# EAGLE schematic Schematic (EAGLE 6.3)
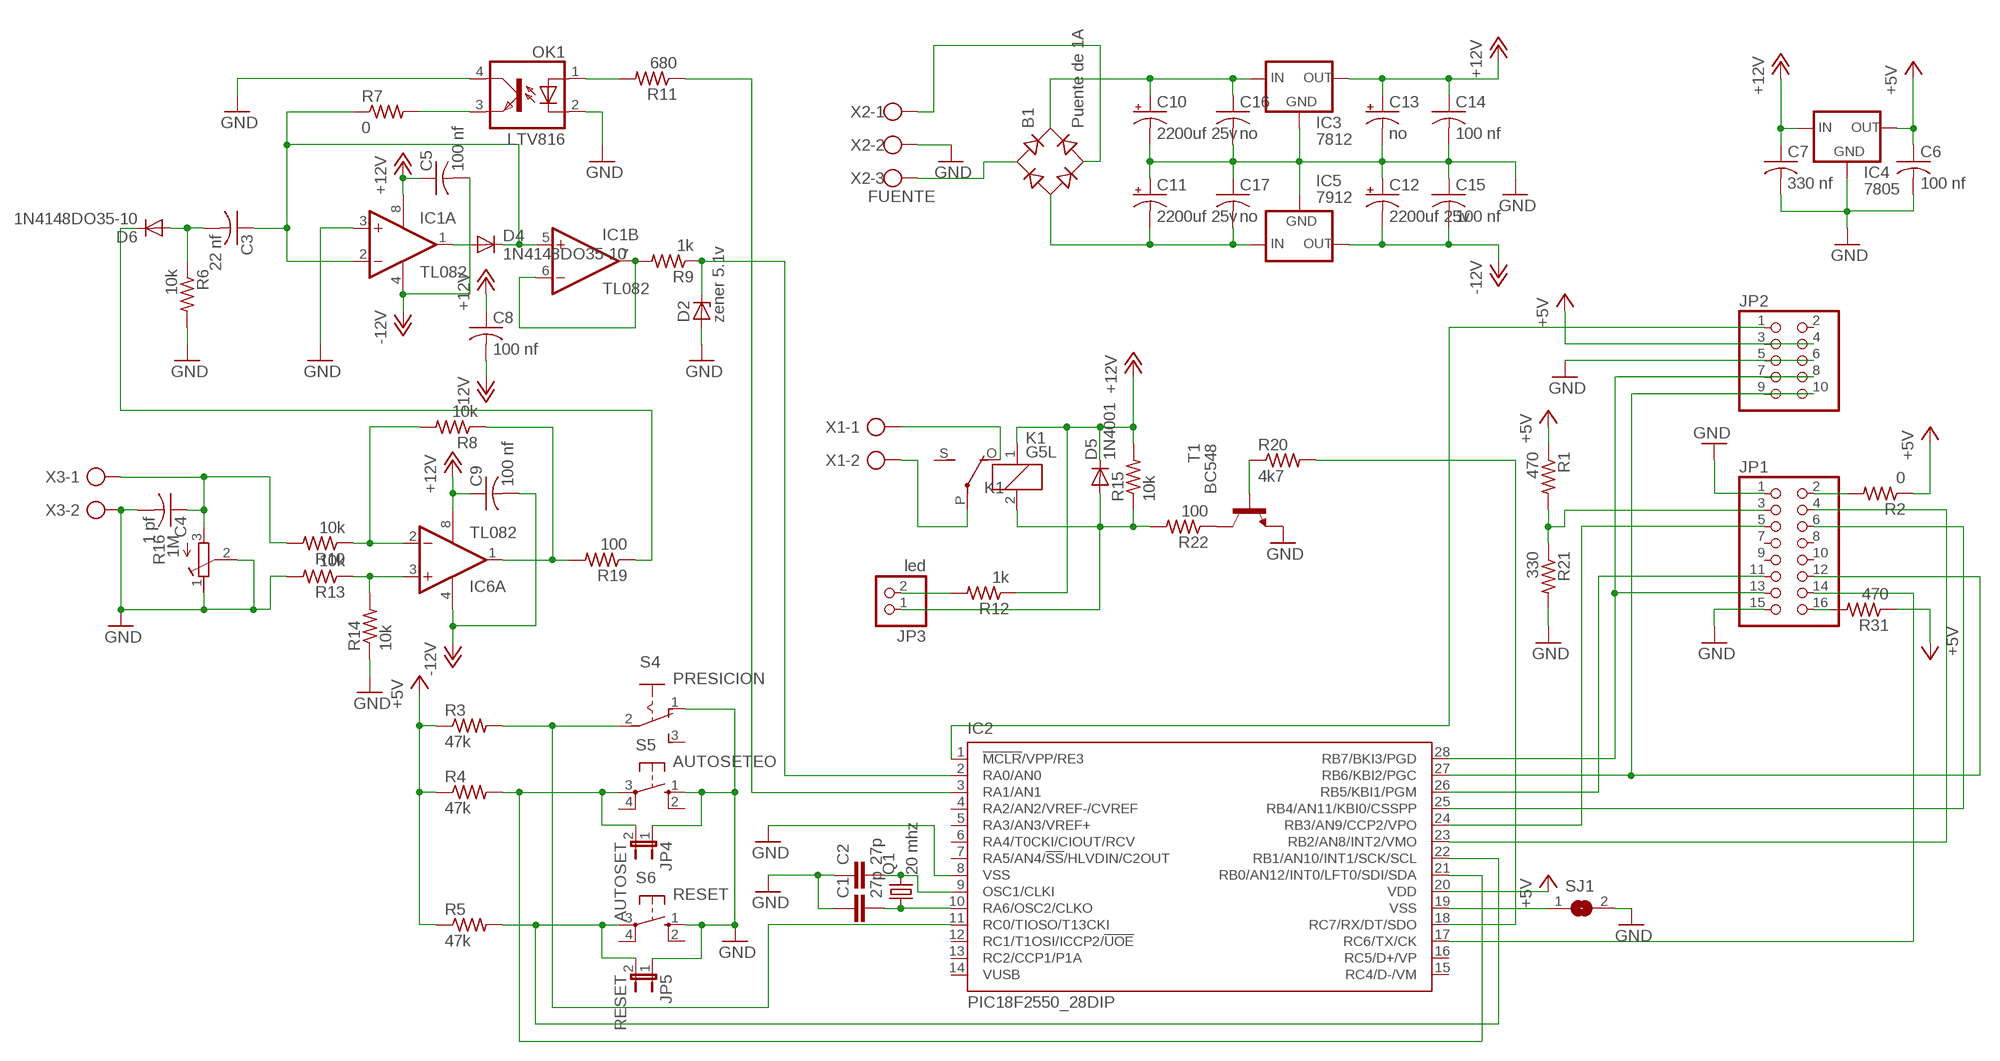
[diagram p0: schematic, sheet 1]

## Parts
B1  Puente de 1A  RB1A  [RB1A]
C1  27p  C-EU050-024X044  [C050-024X044]
C2  27p  C-EU050-024X044  [C050-024X044]
C3  22 nf  C-US050-024X044  [C050-024X044]
C4  1 pf  C-US050-024X044  [C050-024X044]
C5  100 nf  C-US050-024X044  [C050-024X044]
C6  100 nf  C-US050-024X044  [C050-024X044]
C7  330 nf  C-US050-024X044  [C050-024X044]
C8  100 nf  C-US050-024X044  [C050-024X044]
C9  100 nf  C-US050-024X044  [C050-024X044]
C10  2200uf 25v  CPOL-USE7.5-16  [E7,5-16]
C11  2200uf 25v  CPOL-USE7.5-16  [E7,5-16]
C12  2200uf 25v  CPOL-USE7.5-16  [E7,5-16]
C13  no  CPOL-USE7.5-16  [E7,5-16]
C14  100 nf  C-US050-024X044  [C050-024X044]
C15  100 nf  C-US050-024X044  [C050-024X044]
C16  no  C-US050-024X044  [C050-024X044]
C17  no  C-US050-024X044  [C050-024X044]
D2  zener 5.1v  ZENER-DIODEP1-Z12  [P1Z12]
D4  1N4148DO35-10  [DO35-10]
D5  1N4001  1N4004  [DO41-10]
D6  1N4148DO35-10  [DO35-10]
IC1  TL082  LM4558N  [DIL08]
IC2  PIC18F2550_28DIP  [DIL28-3]
IC3  7812  78XXS  [78XXS]
IC4  7805  78XXS  [78XXS]
IC5  7912  79XXS  [79XXS]
IC6  TL082  LM4558N  [DIL08]
JP1  PINHD-2X8  [2X08]
JP2  PINHD-2X5  [2X05]
JP3  led  PINHD-1X2  [1X02]
JP4  AUTOSET  JP1E  [JP1]
JP5  RESET  JP1E  [JP1]
K1  G5L  [G5LE]
OK1  LTV816  [DIL04]
Q1  20 mhz  CRYSTALHC49S  [HC49/S]
R1  470  R-US_0207/10  [0207/10]
R2  0  R-US_0207/10  [0207/10]
R3  47k  R-US_0207/10  [0207/10]
R4  47k  R-US_0207/10  [0207/10]
R5  47k  R-US_0207/10  [0207/10]
R6  10k  R-US_0207/10  [0207/10]
R7  0  R-US_0207/10  [0207/10]
R8  10k  R-US_0207/10  [0207/10]
R9  1k  R-US_0207/10  [0207/10]
R10  10k  R-US_0207/10  [0207/10]
R11  680  R-US_0207/10  [0207/10]
R12  1k  R-US_0207/10  [0207/10]
R13  10k  R-US_0207/10  [0207/10]
R14  10k  R-US_0207/10  [0207/10]
R15  10k  R-US_0207/10  [0207/10]
R16  1M  R-TRIMMT93YA  [RTRIMT93YA]
R19  100  R-US_0207/10  [0207/10]
R20  4k7  R-US_0207/10  [0207/10]
R21  330  R-US_0207/10  [0207/10]
R22  100  R-US_0207/10  [0207/10]
R31  470  R-US_0207/10  [0207/10]
S4  PRESICION  M251  [M251]
S5  AUTOSETEO  10-XX  [B3F-10XX]
S6  RESET  10-XX  [B3F-10XX]
SJ1  SJ  [SJ]
T1  BC548  BC547  [TO92]
X1  AK300/2  [AK300/2]
X2  FUENTE  W237-103  [W237-103]
X3  AK300/2  [AK300/2]

## Nets
+5V: C6.1 IC2.20(VDD) IC4.OUT JP2.3 JP2.4 R1.1 R2.1 R3.1 R4.1 R5.1 R31.1
+12V: C5.1 C7.1 C8.1 C9.1 C13.+ C14.1 D5.C IC1.8(P:V+) IC3.OUT IC4.IN IC6.8(P:V+) K1.1 R12.1 R15.2
-12V: C5.2 C8.2 C9.2 C12.- C15.2 IC1.4(P:V-) IC5.OUT IC6.4(P:V-)
GND: C1.1 C2.1 C4.2 C6.2 C7.2 C10.- C11.+ C12.+ C13.- C14.2 C15.1 C16.2 C17.1 D2.A IC1.3(A:+IN) IC2.8(VSS) IC3.GND IC4.GND IC5.GND JP1.1 JP1.15 JP2.5 JP2.6 JP4.1 JP5.1 OK1.2(C) OK1.4(COL) R6.2 R13.2 R14.1 R16.1(A) R16.2(S) R21.2 S4.1(O) S5.1(S) S6.1(S) SJ1.2 T1.1(E) X2.2 X3.2
N$1: IC6.3(A:+IN) R13.1 R14.2
N$2: JP1.3 R1.2 R21.1
N$3: D6.C R19.1
N$4: JP1.2 R2.2
N$5: JP1.16 R31.2
N$6: C3.2 D6.A R6.1
N$7: IC6.2(A:-IN) R8.2 R10.1
N$8: IC2.23(RB2/AN8/INT2/VMO) JP1.4
N$9: IC2.24(RB3/AN9/CCP2/VPO) JP1.5
N$10: IC2.25(RB4/AN11/KBI0/CSSPP) JP1.6
N$11: IC2.26(RB5/KBI1/PGM) JP1.11
N$12: IC2.27(RB6/KBI2/PGC) JP1.12 JP2.9 JP2.10
N$13: IC2.11(RC0/TIOSO/T13CKI) R3.2 S4.2(P)
N$14: IC2.21(RB0/AN12/INT0/LFT0/SDI/SDA) JP4.2 R4.2 S5.3(P)
N$15: IC2.22(RB1/AN10/INT1/SCK/SCL) JP5.2 R5.2 S6.3(P)
N$16: JP3.2 R12.2
N$17: IC2.28(RB7/BKI3/PGD) JP1.13 JP2.7 JP2.8
N$18: IC2.19(VSS) SJ1.1
N$19: IC2.17(RC6/TX/CK) JP1.14
N$20: C3.1 D4.C IC1.2(A:-IN) IC1.5(B:+IN) R7.1
N$21: IC6.1(A:OUT) R8.1 R19.2
N$22: D4.A IC1.1(A:OUT)
N$23: IC2.1(!MCLR!/VPP/RE3) JP2.1
N$24: C2.2 IC2.9(OSC1/CLKI) Q1.2
N$25: C1.2 IC2.10(RA6/OSC2/CLKO) Q1.1
N$26: B1.+ C10.+ C16.1 IC3.IN
N$27: OK1.1(A) R11.2
N$28: OK1.3(EMIT) R7.2
N$29: IC1.6(B:-IN) IC1.7(B:OUT) R9.2
N$30: K1.P(2:P) X1.2
N$31: B1.- C11.- C17.2 IC5.IN
N$32: B1.AC2 X2.1
N$33: B1.AC1 X2.3
N$34: K1.O(2:O) X1.1
N$35: IC2.18(RC7/RX/DT/SDO) R20.2
N$36: D5.A JP3.1 K1.2 R15.1 R22.2
N$39: D2.C IC2.2(RA0/AN0) R9.1
N$40: IC2.3(RA1/AN1) R11.1
N$45: R22.1 T1.3(C)
N$51: C4.1 R10.2 R16.3(E) X3.1
N$55: R20.1 T1.2(B)
Unconnected: IC2.4(RA2/AN2/VREF-/CVREF) IC2.5(RA3/AN3/VREF+) IC2.6(RA4/T0CKI/CIOUT/RCV) IC2.7(RA5/AN4/!SS!/HLVDIN/C2OUT) IC2.12(RC1/T1OSI/ICCP2/!UOE) IC2.13(RC2/CCP1/P1A) IC2.14(VUSB) IC2.15(RC4/D-/VM) IC2.16(RC5/D+/VP) IC6.5(B:+IN) IC6.6(B:-IN) IC6.7(B:OUT) JP1.7 JP1.8 JP1.9 JP1.10 JP2.2 K1.S(2:S) S4.3(S) S5.2(S1) S5.4(P1) S6.2(S1) S6.4(P1)

## Library data of the parts
B1 = rectifier:RB1A: RECTIFIER 1 A
C1 C2 = rcl:C-EU: CAPACITOR, European symbol
C3-C9 C14-C17 = rcl:C-US: CAPACITOR, American symbol
C10-C13 = rcl:CPOL-US: POLARIZED CAPACITOR, American symbol
D2 = diode:ZENER-DIODE: Z-Diode
D4 D6 = diode:1N4148: DIODE high speed (Philips)
D5 = diode:1N4004: DIODE general purpose rectifier, 1 A
IC1 IC6 = linear:*4558: OP AMP
IC2 = microchip:PIC18F2*_28: USB Microcontrollers with nanoWatt Technology High-Performance, Enhanced Flash, 28/40/44-Pin, Source: http://ww1.microchip.com/downloads/en/devicedoc/39632c.pdf
IC3 IC4 = v-reg:78XXS: VOLTAGE REGULATOR
IC5 = v-reg:79XXS: VOLTAGE REGULATOR
JP1 = pinhead:PINHD-2X8: PIN HEADER
JP2 = pinhead:PINHD-2X5: PIN HEADER
JP3 = pinhead:PINHD-1X2: PIN HEADER
JP4 JP5 = jumper:JP1E: JUMPER
K1 = relay:G5L: RELAY 1 x switch, 10 A/120 V AC, 8 A/30 V ADC, Omron
OK1 = optocoupler:LTV816: OPTO COUPLER Source: LITEON, LTV816.pdf; OC_FARNELL: unknown; OC_NEWARK: unknown
Q1 = crystal:CRYSTAL: CRYSTAL
R1-R15 R19-R22 R31 = resistor:R-US_: RESISTOR, American symbol
R16 = resistor:R-TRIMM: Trimm resistor
S4 = switch:M251: SLIDING SWITCH Mors, distributor Buerklin, 11G702
S5 S6 = switch-omron:10-XX: OMRON SWITCH
SJ1 = jumper:SJ: SMD solder JUMPER
T1 = transistor:BC547: NPN TRANSISTOR
X1 X3 = con-ptr500:AK300/2: CONNECTOR
X2 = con-wago-500:W237-103: WAGO SCREW CLAMP